# Altium schematic sheet Title.SchDoc
size A3; SheetNumber: 1; SheetTotal: 3
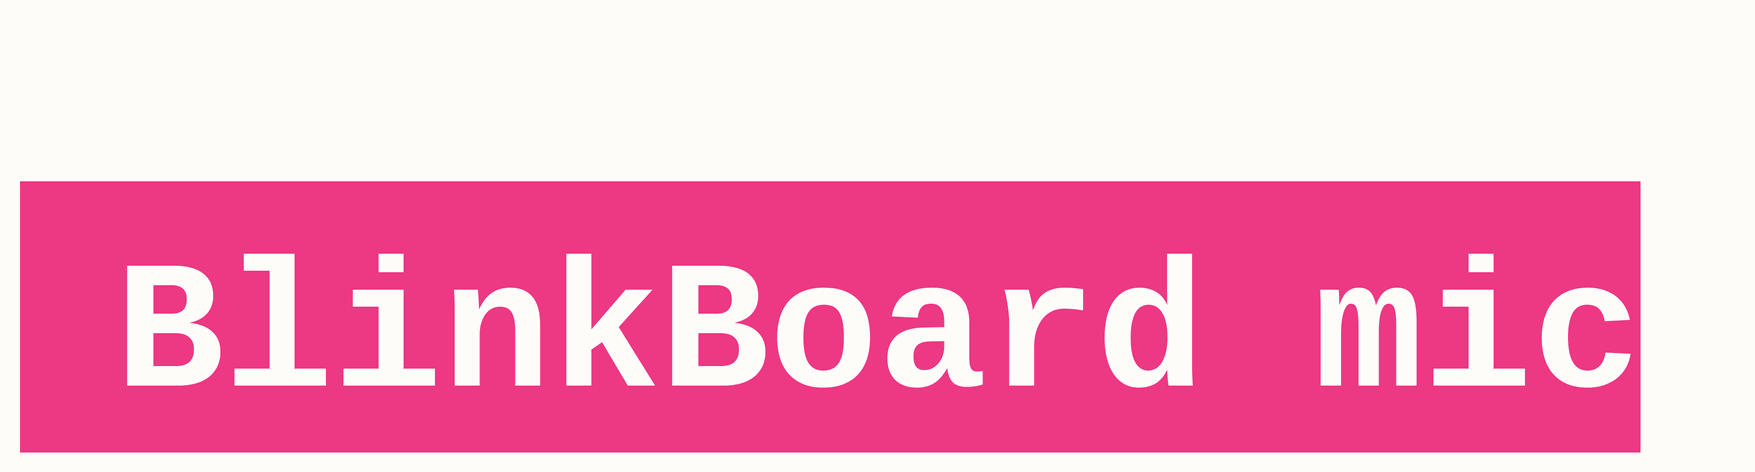
[diagram p0: Title.SchDoc]

## Notes on the sheet
- BlinkBoard micro